# EasyEDA schematic Smart_home_system.json
TITLE: INTELIGENT HOME LIGHT S; REV: 1.0; Date: 2025-07-09; Sheet: 1/1; Company: AOGON FRANCIS
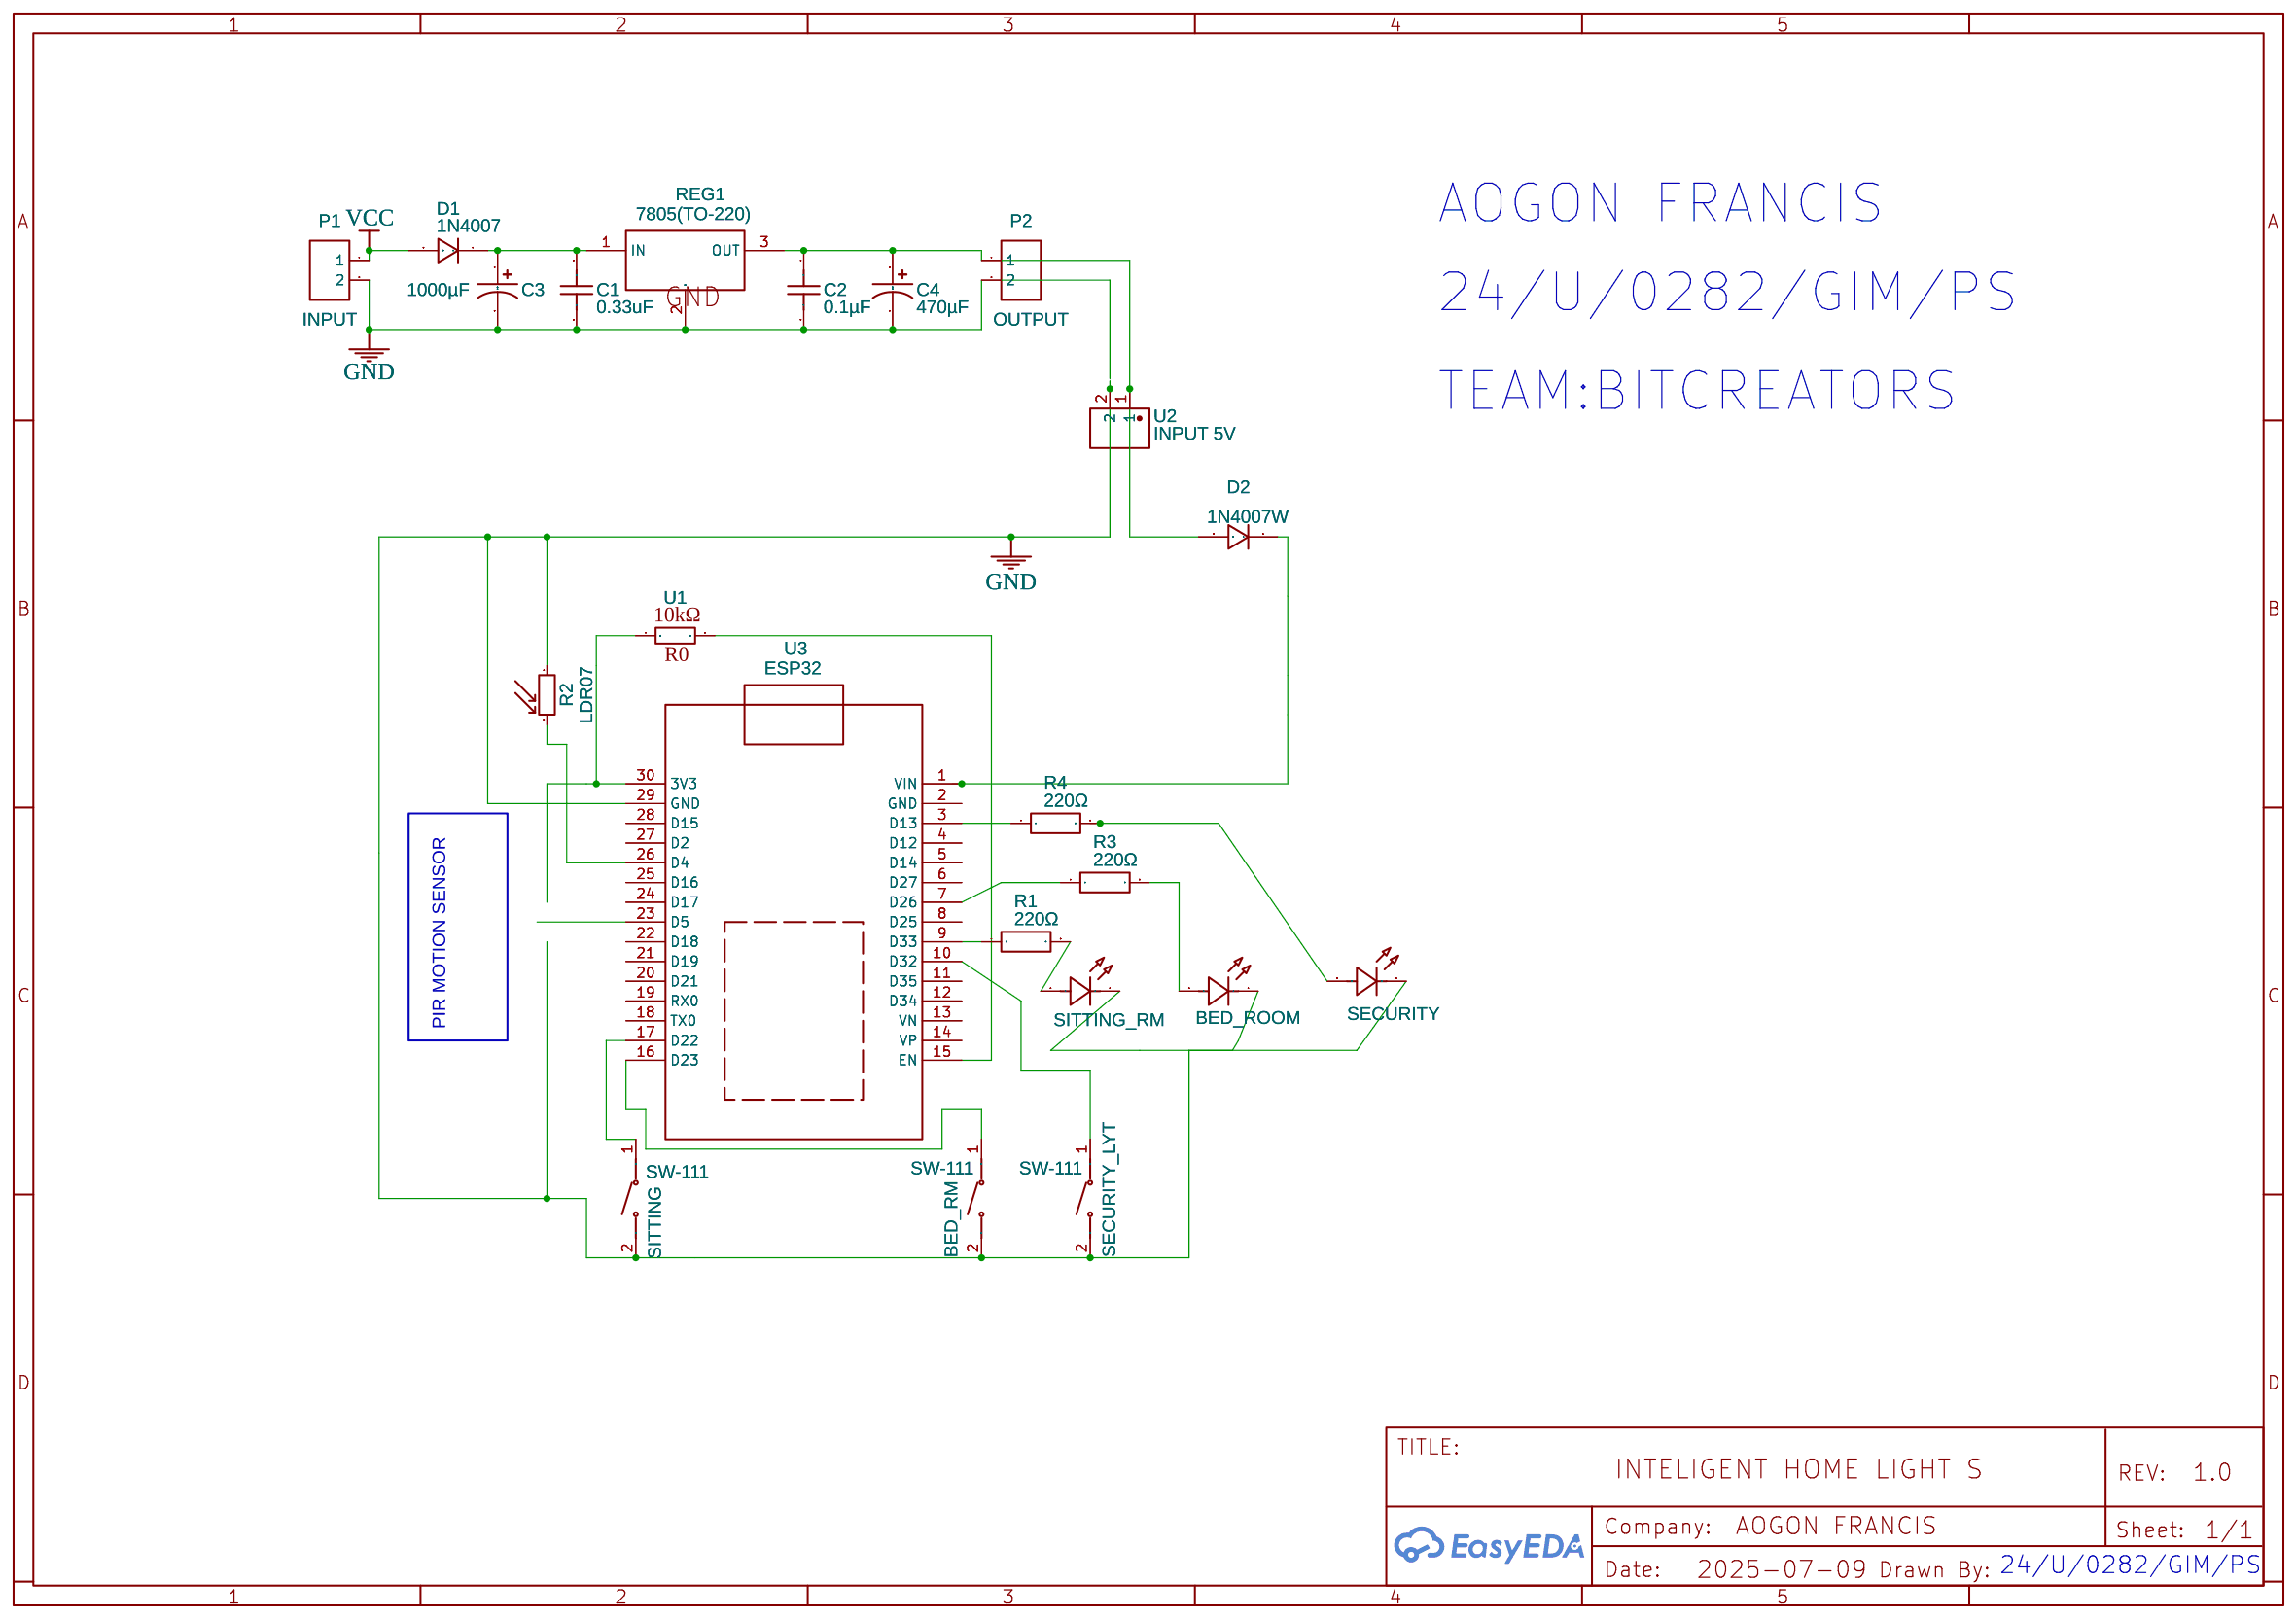
[diagram p0: schematic sheet]

## Parts
BED_RM  SW-111  [SW-TH_SW-111]
C1  0.33uF  [RAD-0.1]
C2  0.1µF  [RAD-0.1]
C3  1000µF  [CAP-D3.0×F1.5]
C4  470µF  [CAP-D3.0×F1.5]
D1  1N4007  [DO-41_BD2.4-L4.7-P8.70-D0.9-RD]
D2  1N4007W  [SOD-123_L2.8-W1.8-LS3.7-RD]
LED1  SECURITY  [LED0603-RD]
LED2  BED_ROOM  [LED0603-RD]
P1  INPUT  [CONN-TH_2P-P5.00]
P2  OUTPUT  [CONN-TH_2P-P5.00]
R1  220Ω  [RESISTOR]
R2  LDR07  [RESISTOR_LDR_5.1X4.3_RM3.4]
R3  220Ω  [RESISTOR]
R4  220Ω  [RESISTOR]
REG1  7805(TO-220)  [TO-220-3_L10.0-W4.5-P2.54-L]
SECURITY_LYT  SW-111  [SW-TH_SW-111]
SITTING  SW-111  [SW-TH_SW-111]
SITTING_RM  LTST-C190KRKT-TH  [LED0603-RD]
U1  10KΩ  [RESISTOR 10KΩ]
U2  INPUT 5V  [CONN-TH_MOLEX_197054001]
U3  ESP32  [ESP32-S]

## Library data of the parts
BED_RM SECURITY_LYT SITTING = SW-111: Contributor: LCSC; Supplier: LCSC; Supplier Part: C294475; Manufacturer: Shinmei(日本神明); JLCPCB Part Class: Extended Part
C1 C2 = C_RAD-0.1_US: Contributor: LCEDA_Lib
C3 C4 = CE_TH_D3.0×F1.5_US: Contributor: LCEDA_Lib
D1 = 1N4007: Supplier: LCSC; Manufacturer: SEMTECH; Supplier Part: C106903; Contributor: LCEDA_Lib
D2 = 1N4007W: Supplier: LCSC; Supplier Part: C328592; Manufacturer: BLUE ROCKET; Contributor: LCEDA_Lib
LED1 LED2 SITTING_RM = LTST-C190KRKT-TH: Contributor: LCSC; Supplier: LCSC; Supplier Part: C284900; Manufacturer: LITEON(光宝); JLCPCB Part Class: Extended Part
P1 P2 = CONN-TH_2P-P5.00: Supplier: LCSC; Contributor: LCEDA_Lib
R1 R3 R4 = RESISTOR: Contributor: Matheus Guilherme
R2 = LDR07: Contributor: KiCAD; license: https://www.gnu.org/licenses/lgpl-2.1.html
REG1 = 7805(TO-220): Supplier: LCSC; Manufacturer: STMicroelectronics; Manufacturer Part: L7805CV-DG; Supplier Part: C3795; Contributor: LCEDA_Lib
U1 = Resistor 10KΩ: Manufacturer Part: Resistor 10kΩ; Contributor: IVI1
U2 = 197054001: Contributor: lcsc; Supplier: LCSC; Supplier Part: C505008; Manufacturer: MOLEX; JLCPCB Part Class: Extended Part
U3 = MyESP32TypeC: Contributor: Firmin49

## Nets
GND: BED_RM.2 C1.2 C2.2 C3.2 C4.2 LED2.1(K) P1.2 P2.2 R2.1 REG1.2(GND) SECURITY_LYT.2 SITTING.2 U2.2 U3.29(GND)
VCC: D1.2 P1.1
Net-(BED_RM-1): BED_RM.1 U3.16(D23)
Net-(C1-1): C1.1 C3.1 D1.1 REG1.1(IN)
Net-(C2-1): C2.1 C4.1 P2.1 REG1.3(OUT)
Net-(D2-1): D2.1 U3.1(VIN)
Net-(D2-2): D2.2 U2.1
Net-(LED1-1): LED1.1(K) SITTING_RM.1(K)
Net-(LED1-2): LED1.2(A) R4.2
Net-(LED2-2): LED2.2(A) R3.2
Net-(R1-1): R1.1 U3.9(D33)
Net-(R1-2): R1.2 SITTING_RM.2(A)
Net-(R2-2): R2.2 U3.26(D4)
Net-(R3-1): R3.1 U3.7(D26)
Net-(R4-1): R4.1 U3.3(D13)
Net-(SECURITY_LYT-1): SECURITY_LYT.1 U3.10(D32)
Net-(SITTING-1): SITTING.1 U3.17(D22)
Net-(U1-1): U1.1(0) U3.30(3V3)
Net-(U1-2): U1.2(0) U3.15(EN)

Not connected (* = marked no-connect by the designer): U3 2(GND) 4(D12) 5(D14) 6(D27) 8(D25) 11(D35) 12(D34) 13(VN) 14(VP) 18(TX0) 19(RX0) 20(D21) 21(D19) 22(D18) 23(D5) 24(D17) 25(D16) 27(D2) 28(D15)

## Notes on the sheet
- AOGON FRANCIS
- 24/U/0282/GIM/PS
- TEAM:BITCREATORS
- PIR MOTION SENSOR
- 24/U/0282/GIM/PS
